# EAGLE design Esquematico_Uno (EAGLE 7.2.0)
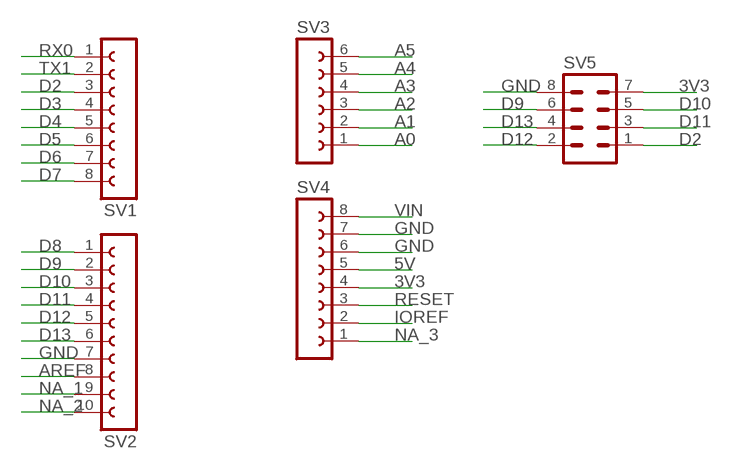
[diagram p0: schematic, sheet 1]

## Parts
SV1  FE08-1  [FE08]
SV2  FE10-1  [FE10]
SV3  FE06-1  [FE06]
SV4  FE08-1  [FE08]
SV5  MA04-2  [MA04-2]

## Nets
3V3: SV4.4 SV5.7
5V: SV4.5
A0: SV3.1
A1: SV3.2
A2: SV3.3
A3: SV3.4
A4: SV3.5
A5: SV3.6
AREF: SV2.8
D2: SV1.3 SV5.1
D3: SV1.4
D4: SV1.5
D5: SV1.6
D6: SV1.7
D7: SV1.8
D8: SV2.1
D9: SV2.2 SV5.6
D10: SV2.3 SV5.5
D11: SV2.4 SV5.3
D12: SV2.5 SV5.2
D13: SV2.6 SV5.4
GND: SV2.7 SV4.6 SV4.7 SV5.8
IOREF: SV4.2
NA_1: SV2.9
NA_2: SV2.10
NA_3: SV4.1
RESET: SV4.3
RX0: SV1.1
TX1: SV1.2
VIN: SV4.8

## Library data of the parts
SV1 SV4 = con-lsta:FE08-1: FEMALE HEADER; OC_FARNELL: unknown; OC_NEWARK: unknown
SV2 = con-lsta:FE10-1: FEMALE HEADER; OC_FARNELL: unknown; OC_NEWARK: unknown
SV3 = con-lsta:FE06-1: FEMALE HEADER; OC_FARNELL: unknown; OC_NEWARK: unknown
SV5 = con-lstb:MA04-2: PIN HEADER; OC_FARNELL: unknown; OC_NEWARK: unknown

## Board
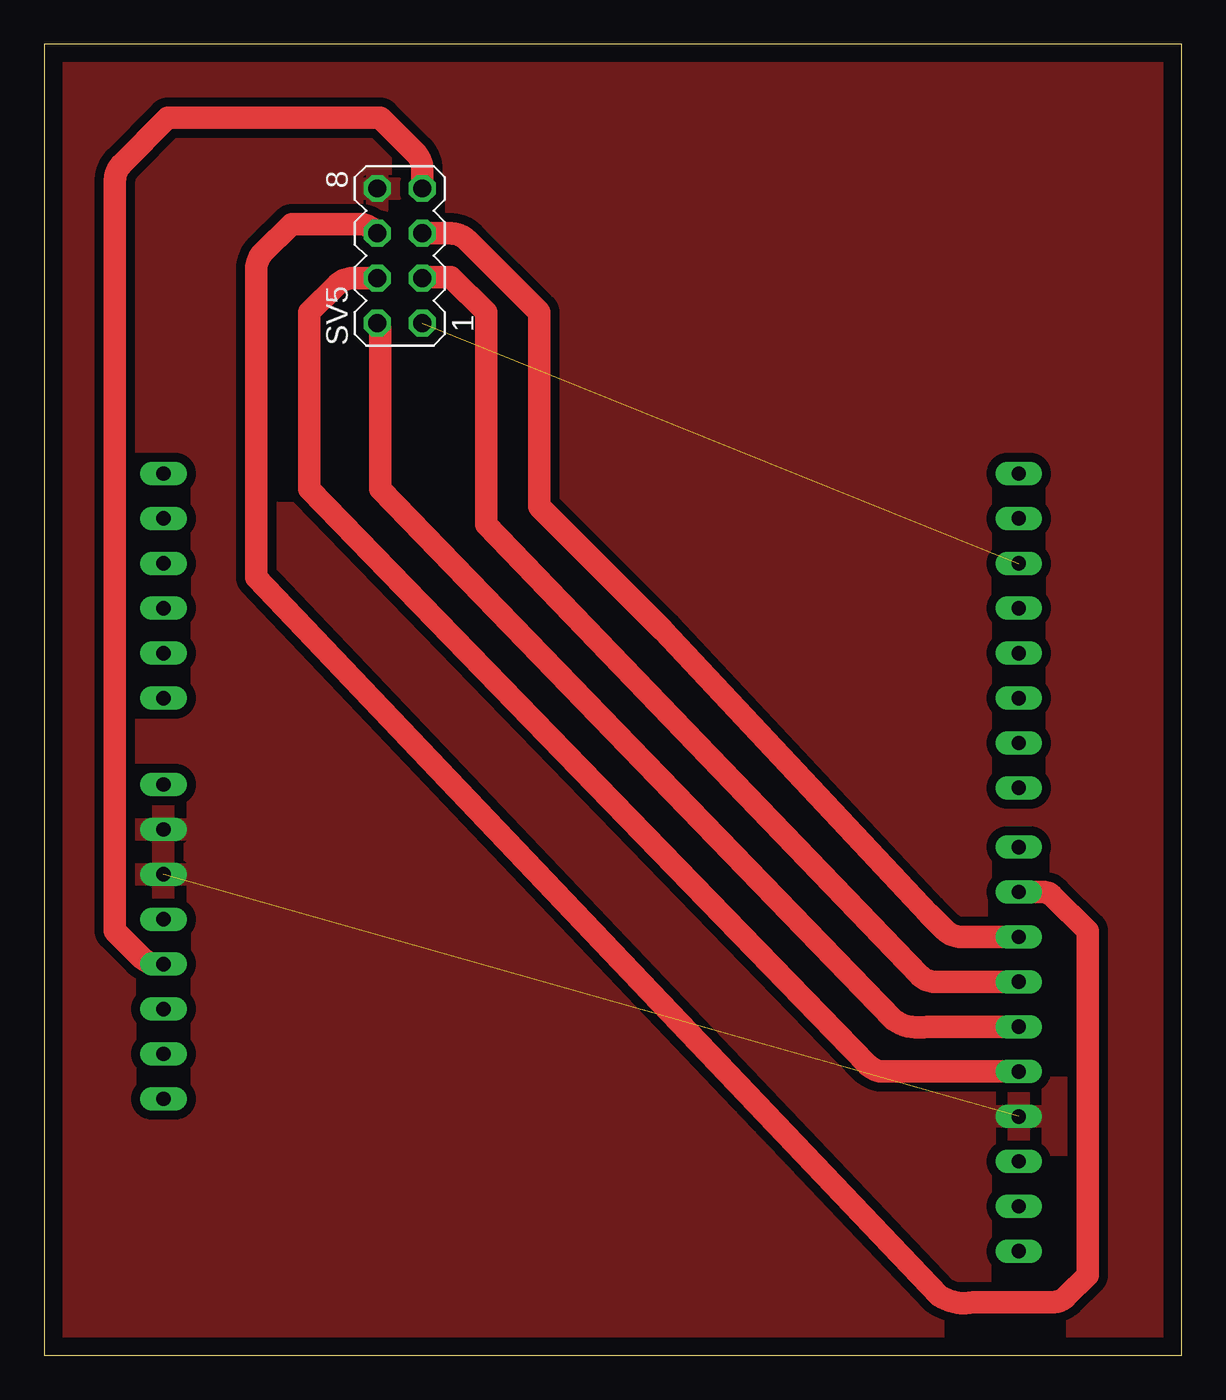
[diagram p1: board, top side]
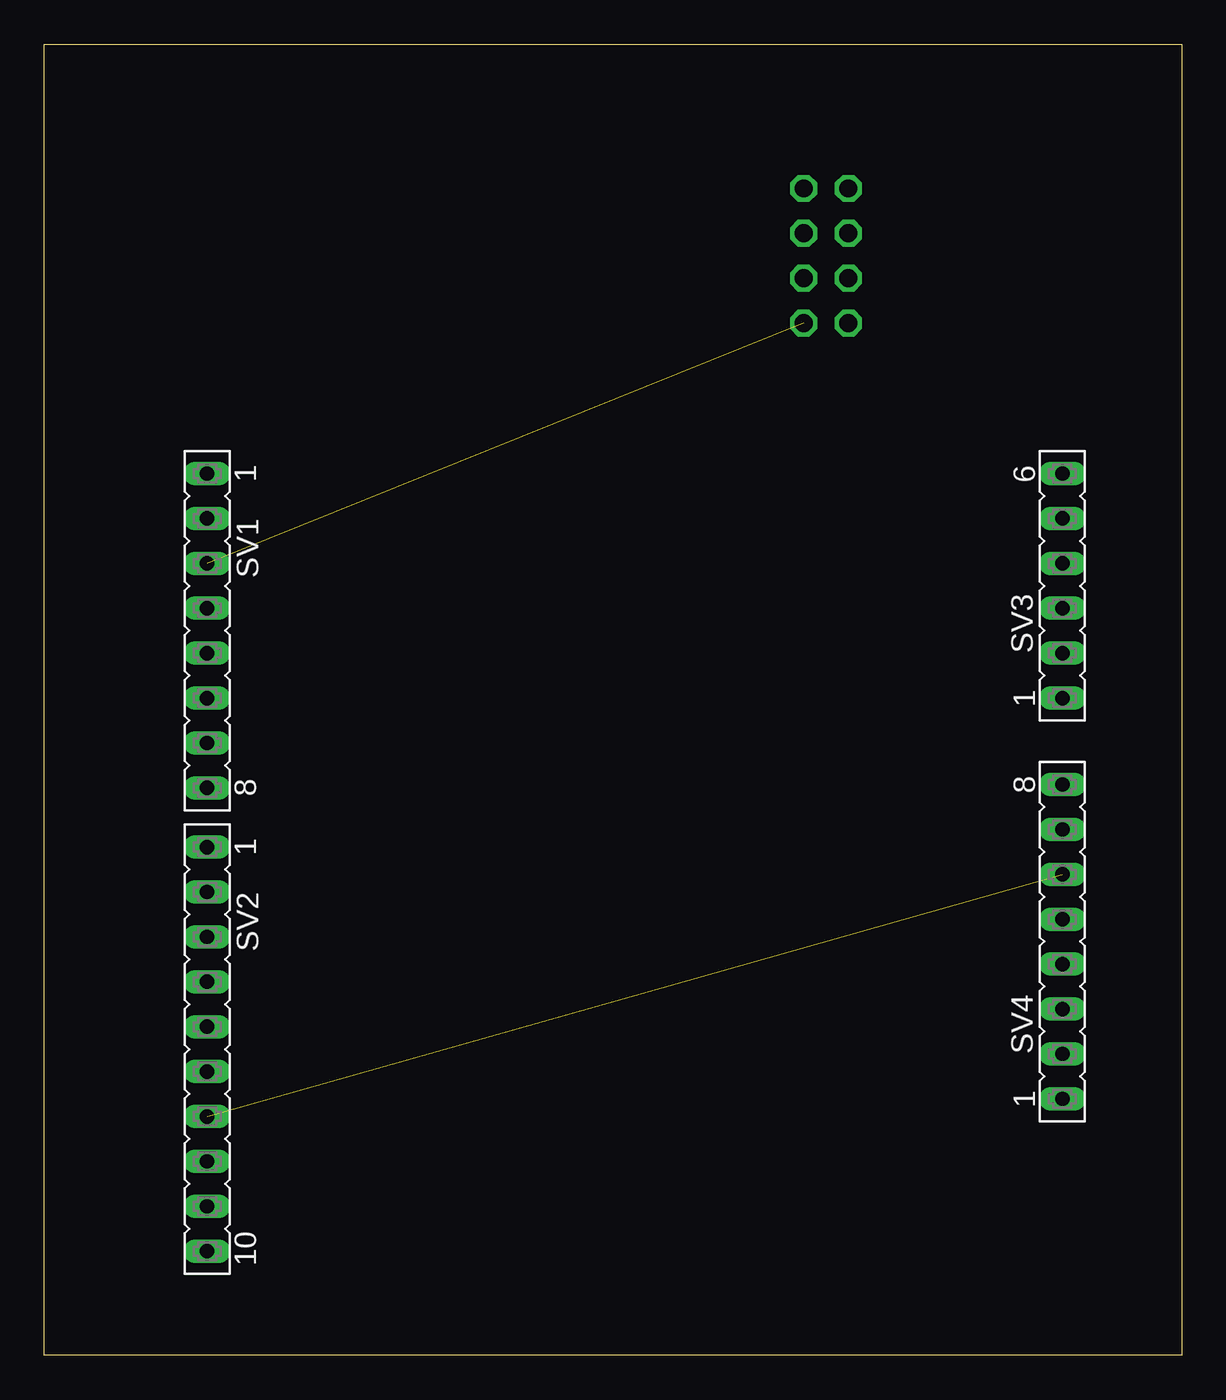
[diagram p2: board, bottom side, seen from below]

Size 64.32 x 74.17 mm. Coordinates in mm from the lower left corner, seen from the top.
Outline: 0,0 64.32,0 64.32,74.17 0,74.17 0,0
Copper layers (1*16): Top 0.035mm / dielectric 1.5mm / Bottom 0.035mm
Design rules "default *": minimum track width 6mil, minimum drill 0.35mm, track to track 20mil, track to pad 20mil, pad to pad 20mil, via to via 20mil, smd to smd 20mil, copper to edge 40mil, drill to drill 6mil, minimum pad ring 10mil, minimum via ring 8mil, stop-mask expansion 4mil, vias tented up to drill 0mil, thermal gap 10mil

### Footprints (pad centres in the part's own frame; a part is rotated, then mirrored left to right if it is on the bottom)
FE08 = drill 0.813 long: 1 -8.89,0; 2 -6.35,0; 3 -3.81,0; 4 -1.27,0; 5 1.27,0; 6 3.81,0; 7 6.35,0; 8 8.89,0
FE10 = drill 0.813 long: 1 -11.43,0; 2 -8.89,0; 3 -6.35,0; 4 -3.81,0; 5 -1.27,0; 6 1.27,0; 7 3.81,0; 8 6.35,0; 9 8.89,0; 10 11.43,0
FE06 = drill 0.813 long: 1 -6.35,0; 2 -3.81,0; 3 -1.27,0; 4 1.27,0; 5 3.81,0; 6 6.35,0
MA04-2 = drill 1.016 octagon: 1 -3.81,-1.27; 2 -3.81,1.27; 3 -1.27,-1.27; 4 -1.27,1.27; 5 1.27,-1.27; 6 1.27,1.27; 7 3.81,-1.27; 8 3.81,1.27

### Placement (x,y rotation side)
SV1  55.11,40.99 270 bottom
SV2  55.11,17.32 270 bottom
SV3  6.74,43.53 90 bottom
SV4  6.74,23.4 90 bottom
SV5  20.11,62.2 90 top

### Tracks (layer width: path | path; a pad name or v marks a point on that pad's centre or on a via)
3V3
  Top 1.27: SV4.4 6.4,22.13 arc-45 5.5,22.5 4,24 4,66.47 arc-45 4.37,67.37 7,70 19,70 21.01,67.99 arc-45 21.38,67.09 SV5.7
D2  (1 unrouted)
D9
  Top 1.27: SV2.2 56.49,26.21 arc-45 57,26 59,24 59,4.53 57.81,3.33 arc-45 57,3 52.53,3 arc-45 50.63,3.37 12,44 12,61.47 arc-45 12.37,62.37 14,64 17.78,64 arc-45 18.68,63.63 SV5.6
D10
  Top 1.27: SV2.3 51.86,23.67 arc-45 50.96,24.04 50,25 35,41 28,48 28,59 23.9,63.1 arc45 23,63.47 SV5.5
D11
  Top 1.27: SV2.4 50.4,21.13 arc-45 49.5,21.5 25,47 25,59 23,61 21.55,61 arc45 SV5.3
D12
  Top 1.27: SV2.5 49.94,18.59 arc-45 48.04,18.96 19,49 19,58 arc45 SV5.2
D13
  Top 1.27: SV2.6 47.48,16.05 arc-45 46.58,16.42 15,49 15,59 16.56,60.56 arc-45 17.46,60.93 SV5.4
GND  (1 unrouted)
  pour Top: 0,0 63,0 63,74 0,74